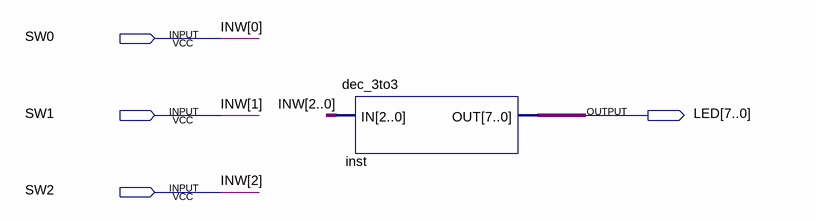
[diagram p0: schematic sheet]
// Quartus schematic START_2_PRO.bdf as structural Verilog: 1 symbols, 4 pins
module START_2_PRO (
  input  SW0,
  input  SW1,
  input  SW2,
  output [7:0] LED
);

  dec_3to3 inst (.IN({SW2, SW1, SW0}), .OUT(LED));

  // Other names for the same wires on the sheet: INW[2:0] = {SW2, SW1, SW0}
endmodule
